# EAGLE design ws2812_clock (EAGLE 6.5.0)

## Sheet 1 of 2
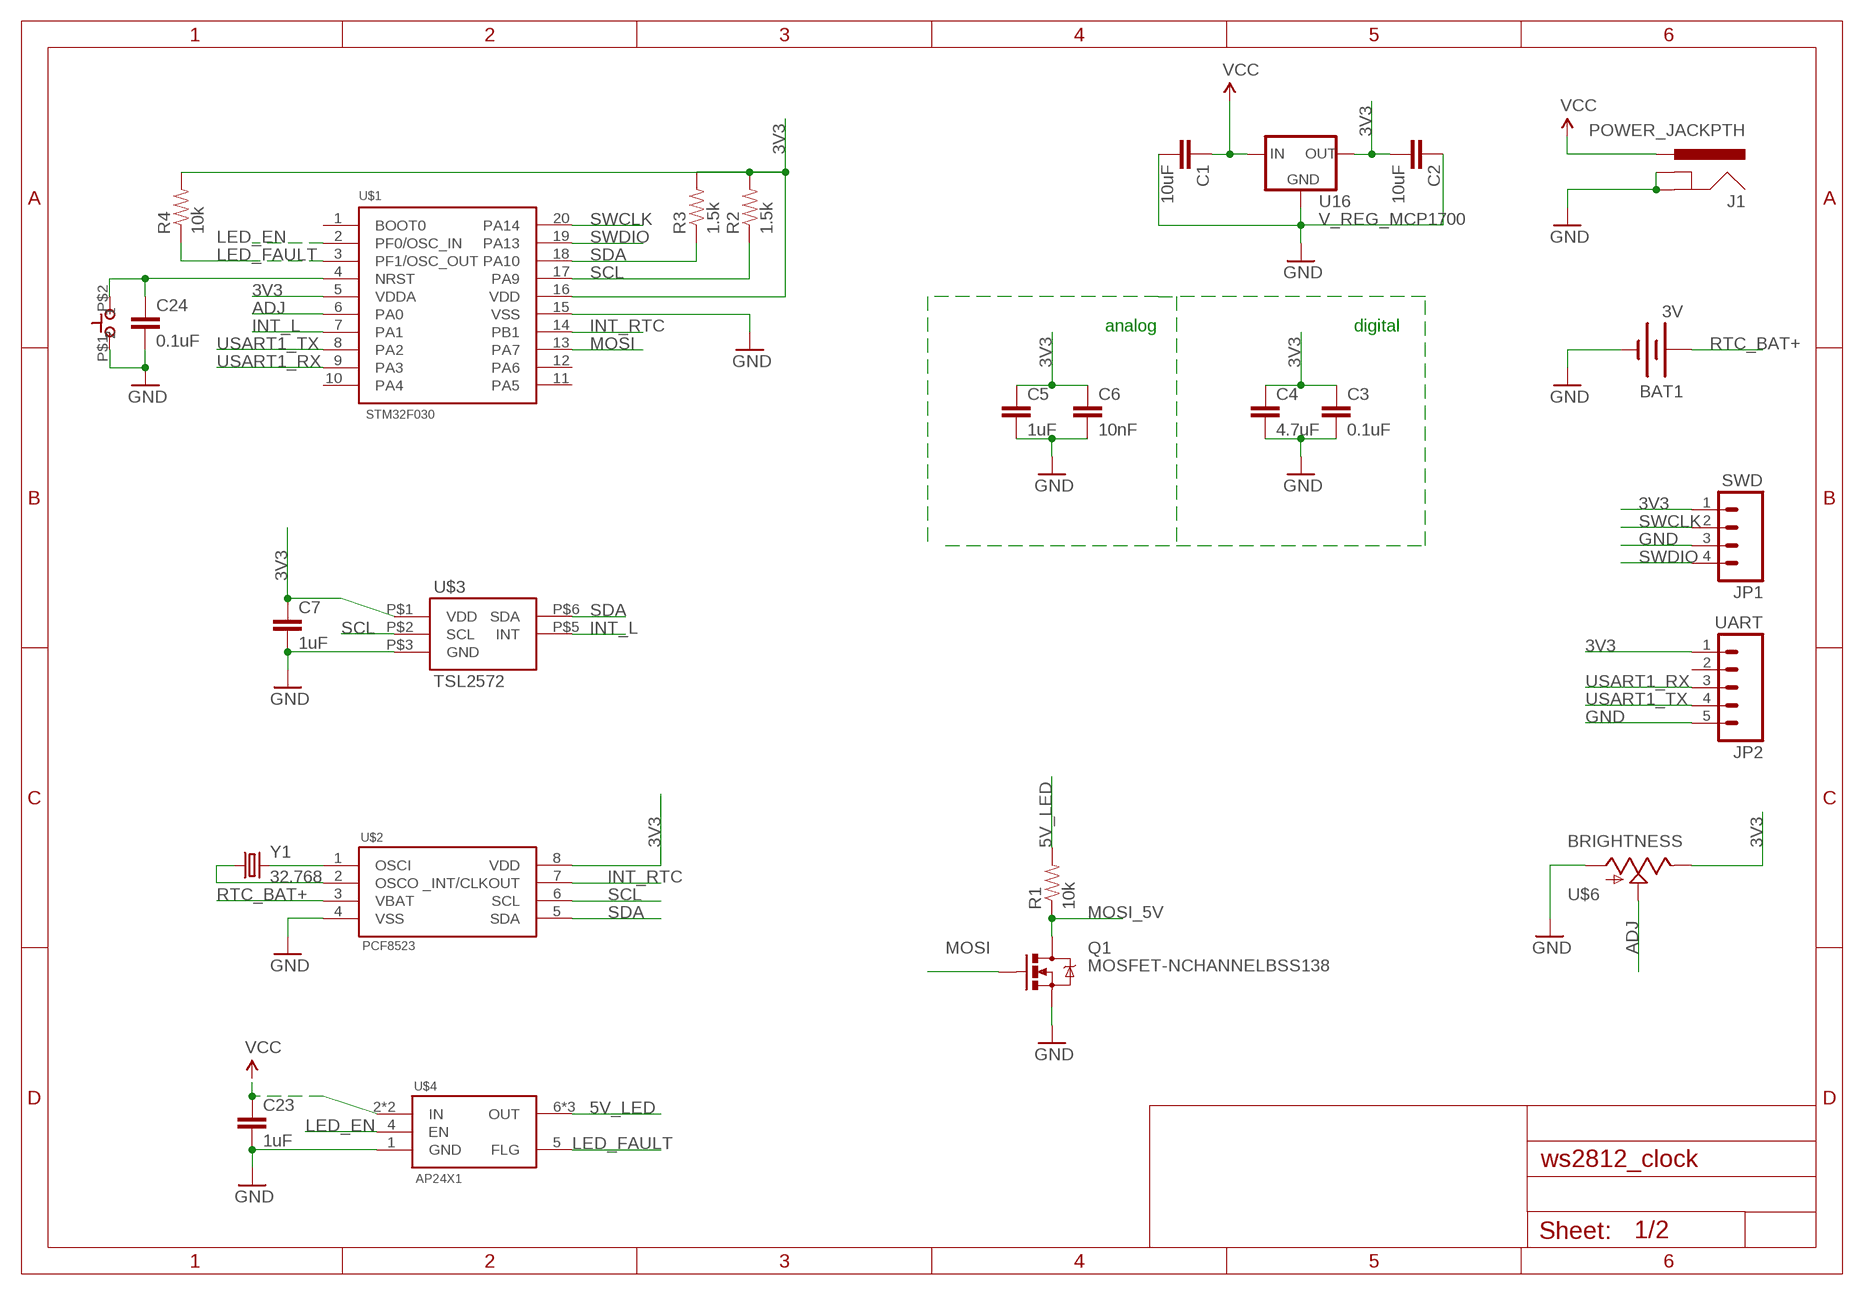
[diagram p0: schematic, sheet 1]

### Parts
BAT1  3V  BATTERY12PTH  [BATTCON_12MM_PTH]
C1  10uF  CAP0805  [0805]
C2  10uF  CAP0805  [0805]
C3  0.1uF  CAP0603-CAP  [0603-CAP]
C4  4.7uF  CAP0805  [0805]
C5  1uF  CAP0805  [0805]
C6  10nF  CAP0603-CAP  [0603-CAP]
C7  1uF  CAP0805  [0805]
C23  1uF  CAP0805  [0805]
C24  0.1uF  CAP0603-CAP  [0603-CAP]
J1  POWER_JACKPTH  [POWER_JACK_PTH]
JP1  SWD  M04PTH  [1X04]
JP2  UART  M05PTH  [1X05]
Q1  MOSFET-NCHANNELBSS138  [SOT23]
R1  10k  RESISTOR0603-RES  [0603-RES]
R2  1.5k  RESISTOR0603-RES  [0603-RES]
R3  1.5k  RESISTOR0603-RES  [0603-RES]
R4  10k  RESISTOR0603-RES  [0603-RES]
U16  V_REG_MCP1700  [SOT23-3]
U$1  STM32F030  [TSSOP20]
U$2  PCF8523  [SO08]
U$3  TSL2572  [FN-6]
U$4  AP24X1  [MSOP8]
U$5  TACTILE-SWITCH  [6X3.5]
U$6  BRIGHTNESS  POTTRIM  [TRIM_POT]
Y1  32.768  CRYSTALCITIZEN  [CRYSTAL-CITIZEN]

### Nets
3V3: C2.2 C3.1 C4.1 C5.1 C6.1 C7.1 JP1.1 JP2.1 R2.2 R3.2 R4.2 U16.2(OUT) U$1.5(VDDA) U$1.16(VDD) U$2.8(VDD) U$3.P$1(VDD) U$6.2(E)
5V_LED: R1.2 U$4.6(OUT) U$4.7(OUT) U$4.8(OUT) ; also sheet 2
ADJ: U$1.6(PA0) U$6.1(S)
GND: BAT1.GND(-) C1.2 C2.1 C3.2 C4.2 C5.2 C6.2 C7.2 C23.2 C24.2 J1.GND J1.GNDBREAK JP1.3 JP2.5 Q1.2(S) U16.1(GND) U$1.15(VSS) U$2.4(VSS) U$3.P$3(GND) U$4.1(GND) U$5.P$1 U$6.3(A) ; also sheet 2
INT_L: U$1.7(PA1) U$3.P$5(INT)
INT_RTC: U$1.14(PB1) U$2.7(_INT/CLKOUT)
LED_EN: U$1.2(PF0/OSC_IN) U$4.4(EN)
LED_FAULT: R4.1 U$1.3(PF1/OSC_OUT) U$4.5(FLG)
MOSI: Q1.1(G) U$1.13(PA7)
MOSI_5V: Q1.3(D) R1.1 ; also sheet 2
N$15: U$2.1(OSCI) Y1.P$2
N$16: U$2.2(OSCO) Y1.P$1
N$17: C24.1 U$1.4(NRST) U$5.P$2
RTC_BAT+: BAT1.VCC@1(+) U$2.3(VBAT)
SCL: R2.1 U$1.17(PA9) U$2.6(SCL) U$3.P$2(SCL)
SDA: R3.1 U$1.18(PA10) U$2.5(SDA) U$3.P$6(SDA)
SWCLK: JP1.2 U$1.20(PA14)
SWDIO: JP1.4 U$1.19(PA13)
USART1_RX: JP2.3 U$1.9(PA3)
USART1_TX: JP2.4 U$1.8(PA2)
VCC: C1.1 C23.1 J1.PWR U16.3(IN) U$4.2(IN) U$4.3(IN)
Unconnected: JP2.2 U$1.1(BOOT0) U$1.10(PA4) U$1.11(PA5) U$1.12(PA6)

### Notes on the sheet
- analog | digital

## Sheet 2 of 2
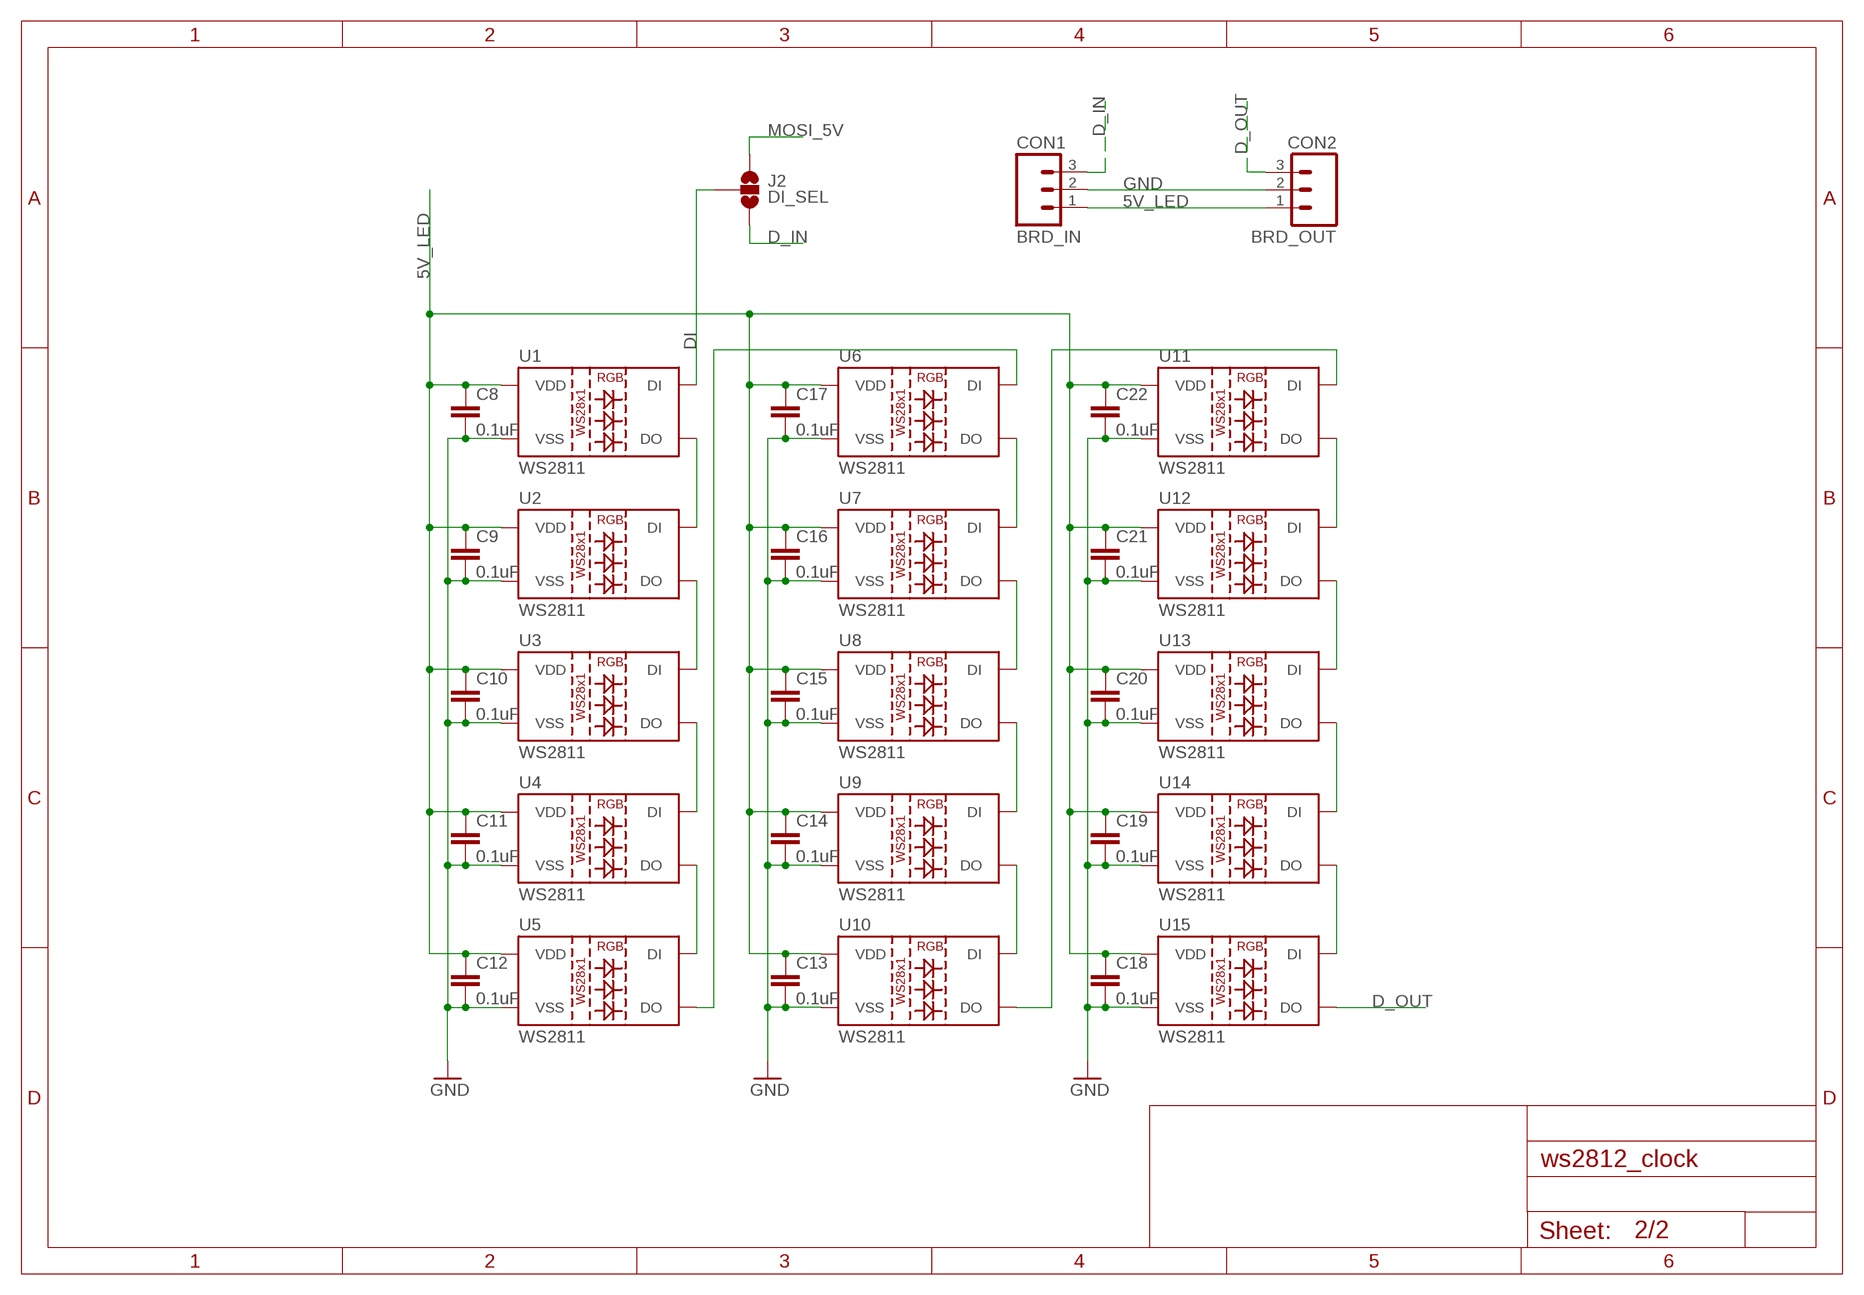
[diagram p1: schematic, sheet 2]

### Parts
C8  0.1uF  CAP0603-CAP  [0603-CAP]
C9  0.1uF  CAP0603-CAP  [0603-CAP]
C10  0.1uF  CAP0603-CAP  [0603-CAP]
C11  0.1uF  CAP0603-CAP  [0603-CAP]
C12  0.1uF  CAP0603-CAP  [0603-CAP]
C13  0.1uF  CAP0603-CAP  [0603-CAP]
C14  0.1uF  CAP0603-CAP  [0603-CAP]
C15  0.1uF  CAP0603-CAP  [0603-CAP]
C16  0.1uF  CAP0603-CAP  [0603-CAP]
C17  0.1uF  CAP0603-CAP  [0603-CAP]
C18  0.1uF  CAP0603-CAP  [0603-CAP]
C19  0.1uF  CAP0603-CAP  [0603-CAP]
C20  0.1uF  CAP0603-CAP  [0603-CAP]
C21  0.1uF  CAP0603-CAP  [0603-CAP]
C22  0.1uF  CAP0603-CAP  [0603-CAP]
CON1  BRD_IN  M03PTH  [1X03]
CON2  BRD_OUT  M03PTH  [1X03]
J2  DI_SEL  SOLDERJUMPER_2WAYT  [SJ_2]
U1  WS2811  LED-TRICOLOR-5050-ICWS2811  [LED-TRICOLOR-5050-IC]
U2  WS2811  LED-TRICOLOR-5050-ICWS2811  [LED-TRICOLOR-5050-IC]
U3  WS2811  LED-TRICOLOR-5050-ICWS2811  [LED-TRICOLOR-5050-IC]
U4  WS2811  LED-TRICOLOR-5050-ICWS2811  [LED-TRICOLOR-5050-IC]
U5  WS2811  LED-TRICOLOR-5050-ICWS2811  [LED-TRICOLOR-5050-IC]
U6  WS2811  LED-TRICOLOR-5050-ICWS2811  [LED-TRICOLOR-5050-IC]
U7  WS2811  LED-TRICOLOR-5050-ICWS2811  [LED-TRICOLOR-5050-IC]
U8  WS2811  LED-TRICOLOR-5050-ICWS2811  [LED-TRICOLOR-5050-IC]
U9  WS2811  LED-TRICOLOR-5050-ICWS2811  [LED-TRICOLOR-5050-IC]
U10  WS2811  LED-TRICOLOR-5050-ICWS2811  [LED-TRICOLOR-5050-IC]
U11  WS2811  LED-TRICOLOR-5050-ICWS2811  [LED-TRICOLOR-5050-IC]
U12  WS2811  LED-TRICOLOR-5050-ICWS2811  [LED-TRICOLOR-5050-IC]
U13  WS2811  LED-TRICOLOR-5050-ICWS2811  [LED-TRICOLOR-5050-IC]
U14  WS2811  LED-TRICOLOR-5050-ICWS2811  [LED-TRICOLOR-5050-IC]
U15  WS2811  LED-TRICOLOR-5050-ICWS2811  [LED-TRICOLOR-5050-IC]

### Nets
5V_LED: C8.1 C9.1 C10.1 C11.1 C12.1 C13.1 C14.1 C15.1 C16.1 C17.1 C18.1 C19.1 C20.1 C21.1 C22.1 CON1.1 CON2.1 U1.3(VDD) U1.5(VDD) U2.3(VDD) U2.5(VDD) U3.3(VDD) U3.5(VDD) U4.3(VDD) U4.5(VDD) U5.3(VDD) U5.5(VDD) U6.3(VDD) U6.5(VDD) U7.3(VDD) U7.5(VDD) U8.3(VDD) U8.5(VDD) U9.3(VDD) U9.5(VDD) U10.3(VDD) U10.5(VDD) U11.3(VDD) U11.5(VDD) U12.3(VDD) U12.5(VDD) U13.3(VDD) U13.5(VDD) U14.3(VDD) U14.5(VDD) U15.3(VDD) U15.5(VDD) ; also sheet 1
D_IN: CON1.3 J2.3
D_OUT: CON2.3 U15.1(DO)
DI: J2.2 U1.2(DI)
GND: C8.2 C9.2 C10.2 C11.2 C12.2 C13.2 C14.2 C15.2 C16.2 C17.2 C18.2 C19.2 C20.2 C21.2 C22.2 CON1.2 CON2.2 U1.6(VSS) U2.6(VSS) U3.6(VSS) U4.6(VSS) U5.6(VSS) U6.6(VSS) U7.6(VSS) U8.6(VSS) U9.6(VSS) U10.6(VSS) U11.6(VSS) U12.6(VSS) U13.6(VSS) U14.6(VSS) U15.6(VSS) ; also sheet 1
MOSI_5V: J2.1 ; also sheet 1
N$1: U1.1(DO) U2.2(DI)
N$2: U2.1(DO) U3.2(DI)
N$3: U3.1(DO) U4.2(DI)
N$4: U4.1(DO) U5.2(DI)
N$5: U5.1(DO) U6.2(DI)
N$6: U6.1(DO) U7.2(DI)
N$7: U7.1(DO) U8.2(DI)
N$8: U8.1(DO) U9.2(DI)
N$9: U9.1(DO) U10.2(DI)
N$10: U10.1(DO) U11.2(DI)
N$11: U11.1(DO) U12.2(DI)
N$12: U12.1(DO) U13.2(DI)
N$13: U13.1(DO) U14.2(DI)
N$14: U14.1(DO) U15.2(DI)

## Library data of the parts
BAT1 = SparkFun-Electromechanical:BATTERY: Battery Holders Various common sizes : AA, AAA, 20mm coin cell and 12mm coin cell. 20MM_4LEGS, BATT-10373
C1-C24 = SparkFun-Passives:CAP: Capacitor Standard 0603 ceramic capacitor, and 0.1" leaded capacitor.
CON1 CON2 = SparkFun-Connectors:M03: Header 3 Standard 3-pin 0.1" header. Use with straight break away headers (SKU : PRT-00116), right angle break away headers (PRT-00553), swiss pins (PRT-00743), machine pins (PRT-00117), and female headers (PRT-00115). Molex polarized connector foot print use with SKU : PRT-08232 with associated crimp pins and housings.
J1 = SparkFun-Connectors:POWER_JACK: Power Jack This is the standard 5.5mm barrel jack for power. The PTH is the most common, proven, reliable, footprint. The Slot footprint only works if the mill layer is transmitted to the PCB fab house so be warned. Spark Fun Electronics SKU : PRT-00119 SMT: CONN-08106 Mating wall wart : TOL-00298 (and others)
J2 = SparkFun-Passives:SOLDERJUMPER_2WAY: Solder Jumper 2 way solder jumper
JP1 = SparkFun:M04: Header 4 Standard 4-pin 0.1" header. Use with straight break away headers (SKU : PRT-00116), right angle break away headers (PRT-00553), swiss pins (PRT-00743), machine pins (PRT-00117), and female headers (PRT-00115). Molex polarized connector foot print use with SKU : PRT-08231 with associated crimp pins and housings. 1MM SMD Version SKU: PRT-10208
JP2 = SparkFun-Connectors:M05: Header 5 Standard 5-pin 0.1" header. Use with straight break away headers (SKU : PRT-00116), right angle break away headers (PRT-00553), swiss pins (PRT-00743), machine pins (PRT-00117), and female headers (PRT-00115). Molex polarized connector foot print use with SKU : PRT-08230 with associated crimp pins and housings.
Q1 = SparkFun-DiscreteSemi:MOSFET-NCHANNEL: Common NMOSFET Parts MFG P/N Store ID Prod ID FDD8780 TRANS-09984 SI7820DN TRANS-11055 FDS6630A IC-08089 2N7002PW TRANS-11151 FQP30N06L COM-10213 TRANS-10060 BSS123LT1G TRANS-08345 BSS138 TRANS-00830 BS170 2N7000; PROD_ID: TRANS-00830
R1-R4 = SparkFun-Passives:RESISTOR: Resistor Basic schematic elements and footprints for 0603, 1206, and PTH resistors.
U1-U15 = SparkFun-LED:LED-TRICOLOR-5050-IC: WS2811 RGB LED w/driver 5x5mm SMD LED with built-in controller IC. DIO-11598; PROD_ID: DIO-11598
U16 = sak:V_REG_MCP1700
U$1 = sak:STM32F030
U$2 = sak:PCF8523
U$3 = sak:TSL2572
U$4 = sak:AP24X1
U$5 = sak:TACTILE-SWITCH
U$6 = SparkFun-Electromechanical:POT
Y1 = sak:CRYSTAL: Crystals Various standard crystals. Proven footprints. Spark Fun Electronics SKU : COM-00534

## Board
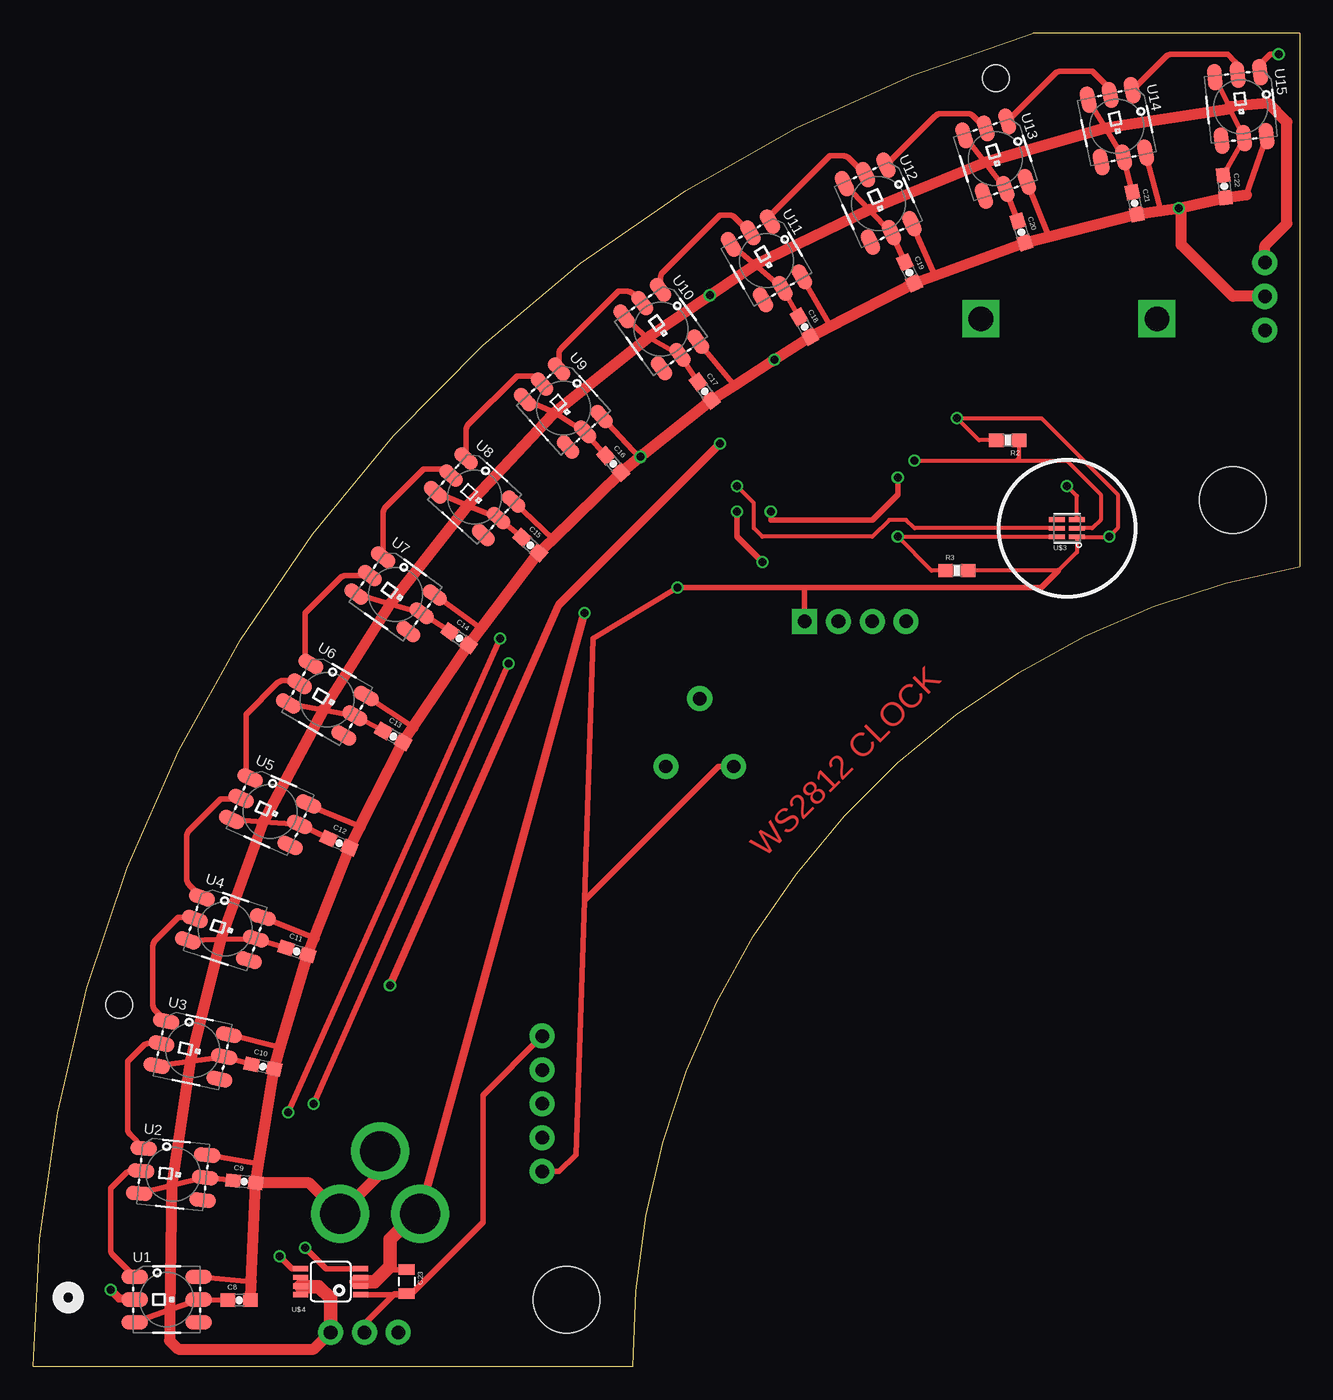
[diagram p2: board, top side]
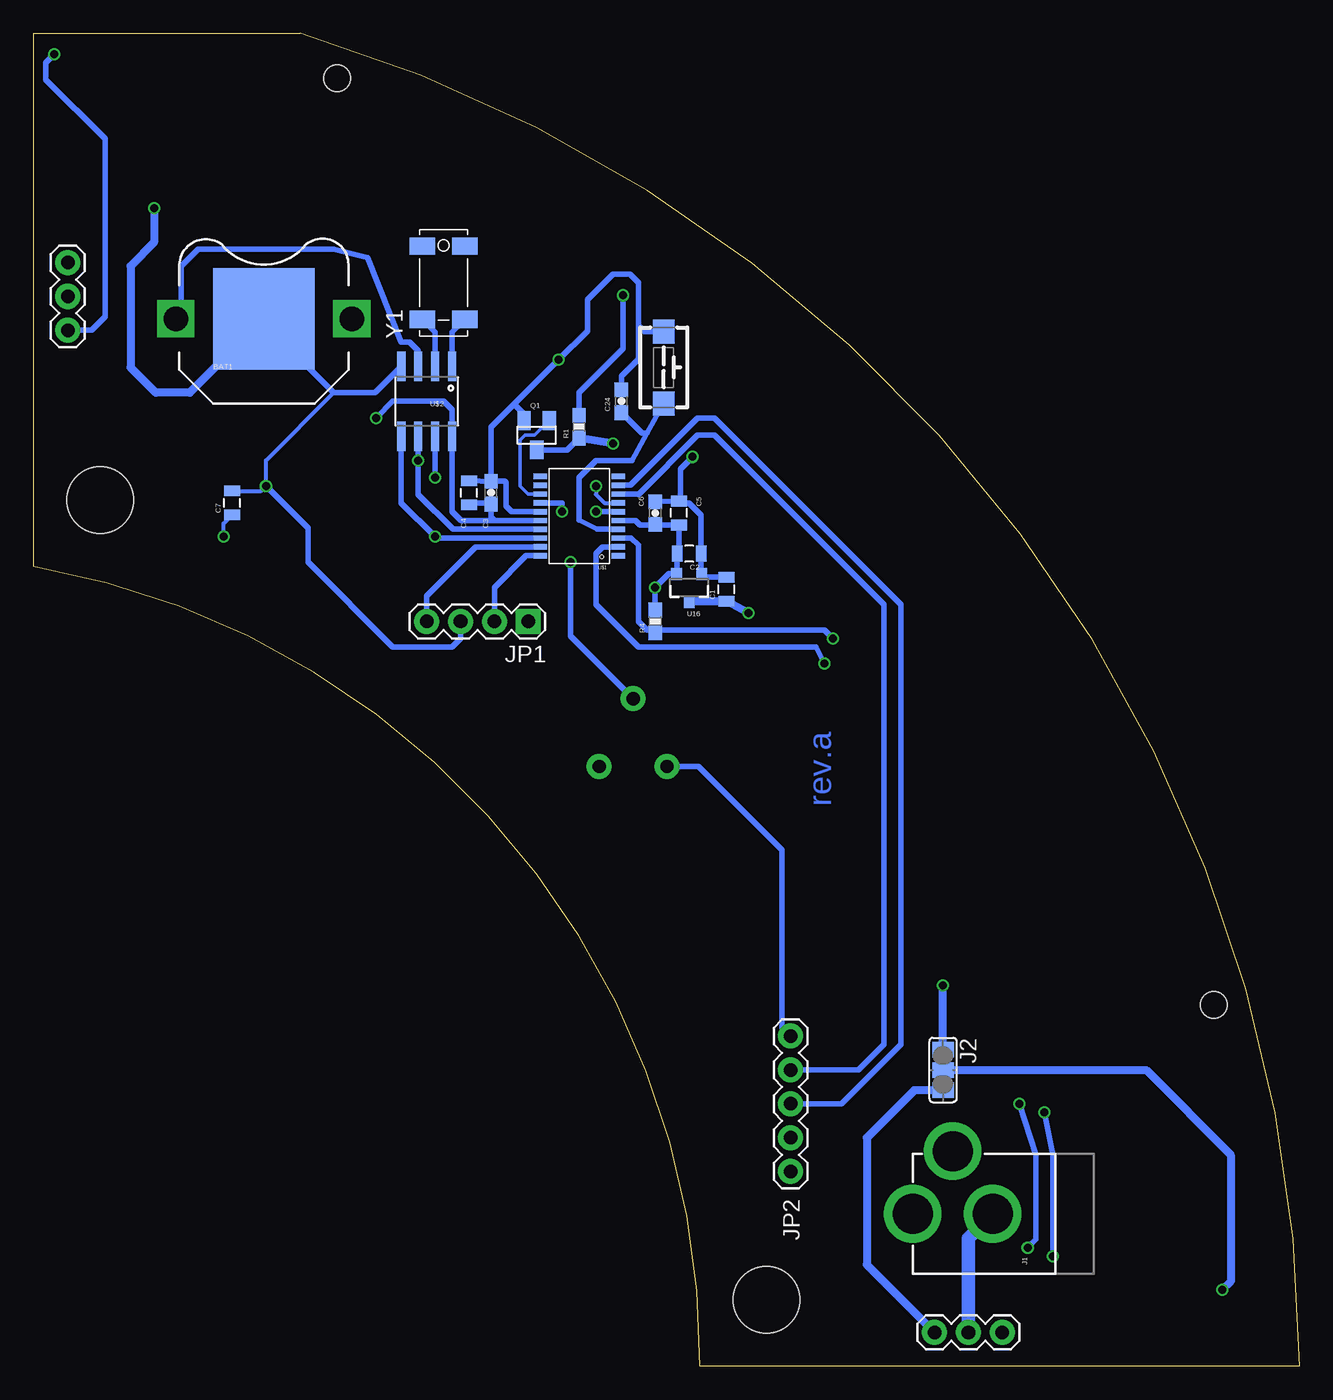
[diagram p3: board, bottom side, seen from below]

Size 95 x 100 mm. Coordinates in mm from the lower left corner, seen from the top.
Outline: 95,100 75,100 arc73 0,0 45,0 arc-81 95,60 95,100
Copper layers (1*16): Top 0.035mm / dielectric 1.5mm / Bottom 0.035mm
Design rules "Fusion_eagle_rule_v1.1": minimum track width 6mil, minimum drill 12mil, track to track 6mil, track to pad 6mil, pad to pad 6mil, via to via 6mil, smd to smd 0mil, copper to edge 10mil, drill to drill 10mil, minimum pad ring 10mil, minimum via ring 6mil, stop-mask expansion 2mil, vias tented up to drill 100mil, thermal gap 10mil
Holes 5 mm at 90,65 40,5
Holes 2 mm at 6.43,27.11 72.22,96.65

### Footprints (pad centres in the part's own frame; a part is rotated, then mirrored left to right if it is on the bottom)
BATTCON_12MM_PTH = smd 7.62 x 7.62: GND 0,0 | drill 1.854 square: VCC@1 -6.604,0; VCC@2 6.604,0
0805 = smd 0.8 x 1.2: 1 -0.9,0; 2 0.9,0
0603-CAP = smd 1.1 x 1: 1 -0.85,0; 2 0.85,0
1X03 = drill 1.016 pad 1.88: 1 0,0; 2 2.54,0; 3 5.08,0
POWER_JACK_PTH = drill 2.997 pad 4.318: GND 0,7.7; GNDBREAK 4.7,10.7; PWR 0,13.7
SJ_2 = smd 1.168 x 1.6: 1 -1.524,0; 2 0,0; 3 1.524,0
1X04 = drill 1.016 pad 1.88 square: 1 0,0 | drill 1.016 pad 1.88: 2 2.54,0; 3 5.08,0; 4 7.62,0
1X05 = drill 1.016 pad 1.88: 1 0,0; 2 2.54,0; 3 5.08,0; 4 7.62,0; 5 10.16,0
SOT23 = smd 1 x 1.4: 1 -0.95,-1.1; 2 0.95,-1.1; 3 0,1.1
0603-RES = smd 1.1 x 1: 1 -0.85,0; 2 0.85,0
LED-TRICOLOR-5050-IC = smd 2 x 1.1: 1 -2.4,1.7; 2 -2.4,0; 3 -2.4,-1.7; 4 2.4,-1.7; 5 2.4,0; 6 2.4,1.7
SOT23-3 = smd 0.8 x 0.9: 1 -0.95,-1; 2 0.95,-1; 3 0,1.1
TSSOP20 = smd 1 x 0.4: 1 -2.937,2.693; 2 -2.937,2.032; 3 -2.937,1.372; 4 -2.937,0.712; 5 -2.937,0.051; 6 -2.937,-0.609; 7 -2.937,-1.27; 8 -2.943,-1.93; 9 -2.937,-2.59; 10 -2.937,-3.251; 11 2.905,-3.251; 12 2.905,-2.59; 13 2.911,-1.93; 14 2.905,-1.27; 15 2.905,-0.609; 16 2.905,0.051; 17 2.905,0.712; 18 2.905,1.372; 19 2.905,2.032; 20 2.905,2.693
SO08 = smd 0.61 x 2.21: 1 -1.905,-2.616; 2 -0.635,-2.616; 3 0.635,-2.616; 4 1.905,-2.616; 5 1.905,2.616; 6 0.635,2.616; 7 -0.635,2.616; 8 -1.905,2.616
FN-6 = smd 1.2 x 0.35: P$1 -0.75,0.65; P$2 -0.75,0; P$3 -0.75,-0.65; P$4 0.75,-0.65; P$5 0.75,0; P$6 0.75,0.65
MSOP8 = smd 0.4 x 1.1: 1 -0.975,-2.25; 2 -0.325,-2.25; 3 0.325,-2.25; 4 0.975,-2.25; 5 0.975,2.25; 6 0.325,2.25; 7 -0.325,2.25; 8 -0.975,2.25
6X3.5 = smd 1.8 x 1.6: P$1 -2.7,0; P$2 2.7,0
TRIM_POT = drill 1 pad 1.88: 1 5.08,0; 2 0,2.54; 3 0,-2.54
CRYSTAL-CITIZEN = smd 1.3 x 1.9: P$1 -2.75,1.6; P$2 -2.75,-1.6; P$3 2.75,-1.6; P$4 2.75,1.6

### Placement (x,y rotation side)
BAT1  77.7,78.58 0 bottom
C1  43.01,58.29 90 bottom
C2  45.8,60.96 180 bottom
C3  60.66,65.53 90 bottom
C4  62.31,65.53 90 bottom
C5  46.56,64.01 90 bottom
C6  48.34,64.01 90 bottom
C7  80.09,64.77 90 bottom
C8  15.45,4.95 0 top
C9  15.83,13.84 354 top
C10  17.23,22.48 348 top
C11  19.77,31.11 342 top
C12  22.94,39.24 336 top
C13  27,47.24 330 top
C14  31.96,54.61 324 top
C15  37.29,61.59 318 top
C16  43.51,67.69 312 top
C17  50.37,73.15 306 top
C18  57.87,77.98 300 top
C19  65.74,82.04 294 top
C20  74.12,85.09 288 top
C21  82.63,87.25 282 top
C22  89.36,88.52 276 top
C23  28.02,6.35 270 top
C24  50.88,72.39 90 bottom
CON1  22.3,2.54 180 bottom
CON2  92.41,82.8 270 bottom
J1  15.32,11.43 90 bottom
J2  26.75,22.23 270 bottom
JP1  57.87,55.88 180 bottom
JP2  38.18,14.61 90 bottom
Q1  57.23,69.85 180 bottom
R1  54.05,70.48 90 bottom
R2  73.11,69.47 180 top
R3  69.3,59.69 0 top
R4  48.34,55.88 90 bottom
U1  10,5 0 top
U2  10.49,14.41 354 top
U3  11.97,23.71 348 top
U4  14.4,32.81 342 top
U5  17.78,41.61 336 top
U6  22.06,50 330 top
U7  27.19,57.9 324 top
U8  33.12,65.22 318 top
U9  39.78,71.88 312 top
U10  47.1,77.81 306 top
U11  55,82.94 300 top
U12  63.39,87.22 294 top
U13  72.19,90.6 288 top
U14  81.29,93.03 282 top
U15  90.59,94.51 276 top
U16  45.8,58.42 180 bottom
U$1  54.05,63.5 180 bottom
U$2  65.48,72.39 180 bottom
U$3  77.55,62.87 180 top
U$4  22.3,6.35 90 top
U$5  47.7,74.93 270 bottom
U$6  50,45 90 bottom
Y1  64.22,81.28 90 bottom

### Tracks (layer width: path | path; a pad name or v marks a point on that pad's centre or on a via)
3V3  (via drill 0.6)
  Top 0.305: R3.2 76.92,59.69 78.3,61.08 U$3.P$1 80.71,62.22 v80.72,62.23 81.36,62.87 81.36,65.41 75.64,71.12 v69.3,71.12 70.95,69.47 R2.2
  Top 0.406: 57.87,58.42 v48.34,58.42 41.99,54.61 41.34,34.92 | 57.87,58.42 75.64,58.42 76.92,59.69 | 57.87,58.42 JP1.1 | JP2.1 39.45,14.61 40.72,15.88 41.34,34.92 | U$6.2 51.42,45 41.34,34.92
  Bottom 0.305: v80.72,62.23 80.72,63.23 C7.1
  Bottom 0.406: U16.2 46.7,59.47 | 46.7,59.47 C2.2 46.57,61.09 46.57,63.12 | U$1.5 49.81,63.45 49.48,63.12 48.35,63.12 | 48.35,63.12 C6.1 | 48.35,63.12 46.57,63.12 | 46.57,63.12 C5.1 | U$1.16 60.41,63.45 | 60.41,63.45 62.89,63.45 63.58,64.14 U$2.8 63.58,71.75 64.22,72.39 68.03,72.39 v69.3,71.12 | 60.41,63.45 60.66,63.7 C3.1 60.8,64.77 62.31,64.77 C4.1 | 46.7,59.47 47.29,59.47 v48.34,58.42 R4.2
5V_LED  (via drill 0.6)
  Top 0.406: C8.1 U1.5 10.23,4.23 U1.3 | C10.1 U3.5 11.76,22.88 U3.3 | C9.1 U2.5 10.37,13.55 U2.3 | C12.1 U5.5 17.23,40.85 U5.3 | C11.1 U4.5 14.06,32 U4.3 | C17.1 U10.5 45.76,77.42 | C16.1 U9.5 39.12,71.53 U9.3 | C15.1 U8.5 32.57,64.58 U8.3 | C14.1 U7.5 26.76,57.19 U7.3 | C13.1 U6.5 21.73,49.24 U6.3 | U11.3 54.13,82.63 U11.5 C18.1 | U12.3 62.71,86.77 U12.5 C19.1 | U13.3 71.39,90.32 U13.5 C20.1 | U14.3 80.42,92.91 U14.5 C21.1 | U15.3 89.72,94.48 89.78,94.36 U15.5 C22.1 | U10.3 45.76,77.42 | 45.76,77.42 46.08,77.13 | U$4.6 U$4.7 U$4.8
  Top 0.813: 89.78,94.36 80.42,92.91 71.39,90.32 62.71,86.77 54.13,82.63 v50.75,80.34 46.35,77.35 46.08,77.13 39.12,71.53 38.97,71.41 32.57,64.58 26.76,57.19 21.73,49.24 17.23,40.85 14.06,32 11.76,22.88 10.37,13.55 10.23,4.23 10.23,1.92 10.88,1.27 21.04,1.27 CON1.1 | CON2.1 92.41,84.07 94.06,85.72 94.06,93.34 92.66,94.74 89.72,94.48
  Top 1.016: CON1.1 22.3,5.08 21.42,5.97 20.11,5.97 U$4.7
  Bottom 0.406: 54.05,71.12 R1.2 54.05,73.03 50.75,76.33 v50.75,80.34
ADJ  (via drill 0.6)
  Top 0.406: v52.78,64.14 52.78,62.23 v54.69,60.33
  Bottom 0.406: U$1.6 52.76,64.11 v52.78,64.14 | v54.69,60.33 54.69,54.77 U$6.1
D_IN
  Bottom 0.61: J2.3 28.91,20.7 32.47,17.14 32.47,7.62 CON1.3
D_OUT  (via drill 0.6)
  Top 0.406: v93.42,98.42 92.79,98.42 92.16,97.79 92.16,97.19 U15.1
  Bottom 0.406: CON2.3 90.63,77.72 89.61,78.74 89.61,92.08 94.06,96.52 94.06,97.79 v93.42,98.42
DI  (via drill 0.6)
  Top 0.61: v5.79,5.71 6.43,5.08 7.52,5.08 U1.2
  Bottom 0.61: J2.2 11.51,22.23 5.16,15.88 5.16,6.35 v5.79,5.71
GND  (via drill 0.6)
  Top 0.305: U$3.P$3 78.3,65.29 v77.55,66.04
  Top 0.406: U1.6 16.36,6.33 | U2.6 16.91,15.19 | U3.6 18.54,23.93 | U4.6 17.23,33.66 21.07,32.12 | U5.6 21.04,41.91 24.52,40.48 | U6.6 28.49,47.94 | U7.6 33.59,55.35 | U8.6 38.98,62.06 | U9.6 45.49,68.18 C16.2 | U11.6 59.81,78.03 | U12.6 67.65,81.83 | U13.6 76.21,84.74 | U14.6 84.58,86.68 | 91.01,87.88 U15.6 | U10.6 52.61,73.58 | U$4.1 27.31,5.38 C23.2 | C23.2 27.12,5.45 24.84,3.17 CON1.2 | v55.59,75.5 55.53,75.5 55.43,75.4 | C23.2 28.39,5.45 33.73,10.79 33.73,20.32 JP2.5
  Top 0.813: C8.2 16.36,6.33 C9.2 | C9.2 16.91,15.19 C10.2 18.54,23.93 C11.2 21.07,32.12 C12.2 24.52,40.48 C13.2 28.49,47.94 C14.2 33.59,55.35 C15.2 38.98,62.06 C16.2 v45.55,68.23 C17.2 52.61,73.58 55.43,75.4 v55.59,75.5 C18.2 59.81,78.03 C19.2 67.65,81.83 C20.2 76.21,84.74 C21.2 84.58,86.68 v85.94,86.88 | v85.94,86.88 C22.2 91.01,87.88 | C9.2 20.7,13.75 J1.GND 26.02,14.43 J1.GNDBREAK | CON2.2 90,80.26 86.12,84.14 86.12,86.69 v85.94,86.88
  Bottom 0.305: 72.47,73.03 77.55,67.94 v77.55,66.04 77.92,65.67 C7.2
  Bottom 0.406: C1.2 44.62,59.19 U16.1 44.9,59.47 C2.1 44.9,63.87 45.8,64.77 46.42,64.77 C5.2 | BAT1.GND 77.7,78.26 72.47,73.03 69.37,73.03 U$2.4 | C5.2 C6.2 | U$1.15 59.11,64.11 59.52,64.52 59.52,66.29 59.64,66.42 60.65,66.42 | 60.65,66.42 C3.2 C4.2 | 60.65,66.42 60.65,70.45 58.92,72.17 | 58.92,72.17 v55.59,75.5 53.42,77.67 53.42,80.01 51.52,81.92 50.24,81.92 49.61,81.28 49.61,78.11 | Q1.2 58.18,71.44 58.92,72.17 | v45.55,68.23 45.55,68.19 46.44,67.31 46.44,65.03 C5.2 | JP1.3 62.94,54.61 63.58,53.98 68.03,53.98 74.38,60.33 74.38,62.87 v77.55,66.04 | C24.2 50.88,74.3 49.61,75.56 49.61,78.11 | U$6.3 45.08,45 38.81,38.73 38.81,25.4 JP2.5 | U$5.P$1 49.13,77.63 49.61,78.11
  Bottom 0.61: BAT1.GND 83.27,73.03 85.81,73.03 87.71,74.93 87.71,82.55 85.94,84.33 v85.94,86.88
  Bottom 1.016: CON1.2 24.84,9.61 J1.GND
INT_L  (via drill 0.6)
  Top 0.305: 76.92,62.87 U$3.P$5 66.12,62.87 65.48,63.5 64.22,63.5 62.94,62.23 54.69,62.23 54.05,62.87 54.05,64.77 v52.78,66.04
  Bottom 0.305: v52.78,66.04 52.78,65.41 52.15,64.77 U$1.7 | U$1.7
INT_RTC  (via drill 0.6)
  Top 0.406: v64.85,66.67 64.85,65.41 62.94,63.5 55.33,63.5 v55.33,64.14
  Bottom 0.406: U$2.7 v64.85,66.67 | v55.33,64.14 55.33,64.77 U$1.14 | U$1.14
LED_EN  (via drill 0.6)
  Top 0.406: U$4.4 21.96,7.33 v20.4,8.89 | v21.04,19.68 v35.64,52.7
  Bottom 0.406: v20.4,8.89 19.77,9.53 19.77,15.88 v21.04,19.68 | U$1.2 52.28,61.47 52.78,60.96 52.78,57.15 49.61,53.98 36.27,53.98 v35.64,52.7
LED_FAULT  (via drill 0.6)
  Top 0.406: U$4.5 19.43,7.33 v18.5,8.26 | v19.13,19.05 v35.01,54.61
  Bottom 0.406: v18.5,8.26 18.5,15.88 v19.13,19.05 | U$1.3 50.14,62.13 49.61,61.59 49.61,55.88 48.98,55.24 48.55,55.24 R4.1 48.12,55.24 35.64,55.24 v35.01,54.61
MOSI
  Bottom 0.254: U$1.13 57.89,65.43 58.5,66.04 58.5,69.47 58.12,69.85 57.38,69.85 Q1.1
MOSI_5V  (via drill 0.6)
  Top 0.61: v26.75,28.57 39.45,57.15 v51.52,69.22
  Bottom 0.406: Q1.3 54.94,68.75 R1.1
  Bottom 0.61: J2.1 v26.75,28.57 | v51.52,69.22 R1.1
N$1
  Top 0.406: U1.1 5.98,8.32 arc-45 5.79,8.77 5.79,13.34 6.93,14.47 arc-45 7.38,14.66 U2.2
N$2
  Top 0.406: U2.1 7.25,17.38 arc-45 7.06,17.83 7.06,22.86 8.23,24.02 arc-45 8.68,24.21 U3.2
N$3
  Top 0.406: U3.1 9.16,26.69 arc-45 8.97,27.14 8.97,31.49 arc-45 9.16,31.94 10.88,33.66 11.88,33.66 arc-45 U4.2
N$4
  Top 0.406: U4.1 11.7,36.12 arc-45 11.51,36.57 11.51,39.74 arc-45 11.7,40.19 14.05,42.55 15.5,42.55 arc45 U5.2
N$5
  Top 0.406: U5.1 16.14,44.27 arc-45 15.95,44.72 15.95,48.9 18.31,51.25 arc-45 18.76,51.44 19.13,51.44 19.18,51.39 arc45 19.63,51.2 U6.2
N$6
  Top 0.406: U6.1 20.59,52.92 arc-45 20.4,53.37 20.4,56.52 23.01,59.12 arc-45 23.46,59.31 U7.2
N$7
  Top 0.406: U8.2 31.04,67.12 arc45 30.59,67.31 29.29,67.31 26.43,64.45 arc45 26.25,64 U7.1
N$8
  Top 0.406: U9.2 37.73,74.11 arc45 37.28,74.3 36.27,74.3 32.66,70.68 arc45 32.47,70.23 U8.1
N$9
  Top 0.406: U10.2 44.98,80.46 arc45 44.53,80.64 43.9,80.64 39.62,76.37 arc45 39.44,75.92 U9.1
N$10
  Top 0.406: U11.2 52.65,86.17 arc45 52.2,86.36 51.52,86.36 47.25,82.09 arc45 47.06,81.65 U10.1
N$11
  Top 0.406: U12.2 61.21,90.62 arc45 60.76,90.81 59.77,90.81 55.46,86.49 arc45 55.27,86.04 U11.1
N$12
  Top 0.406: U13.2 70.53,93.79 arc45 70.08,93.98 68.11,93.98 arc45 67.66,93.79 U12.1
N$13
  Top 0.406: U13.1 76.63,96.97 arc-45 77.08,97.16 79.45,97.16 80.6,96.01 arc-45 80.79,95.56 U14.2
N$14
  Top 0.406: U14.1 84.96,98.24 arc-45 85.41,98.42 89.61,98.42 90.16,97.88 arc-45 90.34,97.44 U15.2
N$15
  Bottom 0.406: U$2.1 63.58,77.56 Y1.P$2
N$16
  Bottom 0.406: U$2.2 64.85,77.56 Y1.P$1
N$17
  Bottom 0.406: U$1.4 52.71,62.79 54.05,63.5 54.05,66.67 52.78,67.94 50.09,67.94 48.94,70 | 48.94,70 U$5.P$2 | 48.94,70 49.34,70 C24.1
RTC_BAT+
  Bottom 0.406: U$2.3 66.12,76.2 66.75,76.83 67.39,76.83 69.93,83.19 72.47,83.82 82.63,83.82 83.9,82.55 83.9,78.99 BAT1.VCC@1
SCL  (via drill 0.6)
  Top 0.305: v66.12,67.94 73.74,67.94 | 73.74,67.94 77.55,67.94 80.09,65.41 80.09,63.5 79.45,62.87 U$3.P$2 | R2.1 73.95,68.16 73.74,67.94
  Bottom 0.406: U$1.17 63.5,62.79 66.12,65.41 v66.12,67.94 U$2.6
SDA  (via drill 0.6)
  Top 0.305: U$3.P$6 64.86,62.22 v64.85,62.23 67.39,59.69 R3.1
  Bottom 0.406: U$1.18 64.75,62.13 v64.85,62.23 67.39,64.77 U$2.5
SWCLK
  Bottom 0.406: U$1.20 58.02,60.81 60.41,58.42 JP1.2
SWDIO
  Bottom 0.406: U$1.19 61.8,61.47 65.48,57.78 JP1.4
USART1_RX
  Bottom 0.406: U$1.9 50.2,66.09 45.16,71.12 43.9,71.12 29.92,57.15 29.92,24.13 34.37,19.68 JP2.3
USART1_TX
  Bottom 0.406: U$1.8 49.63,65.43 49.61,65.41 45.16,69.85 43.9,69.85 31.2,57.15 31.2,24.13 33.1,22.23 JP2.4
VCC  (via drill 0.6)
  Top 0.406: U$4.3 U$4.2 24.54,6.03 24.21,6.35 | C23.1 27.12,7.25 26.75,7.62
  Top 0.61: J1.PWR v41.35,56.52
  Top 1.016: J1.PWR 28.66,11.43 26.75,9.53 26.75,7.62 26.75,7.49 25.61,6.35 24.21,6.35
  Bottom 0.406: U16.3 45.73,57.39
  Bottom 0.61: 45.73,57.39 C1.1 v41.35,56.52

### Text on the board
Top: WS2812 CLOCK
Bottom: rev.a
bValues: 5V | GND | DOUT | brightness | GND | TX_OUT | RX_IN | 3V3 | GND | 5V | DIN